# EAGLE design AS3364_waveform_VCA_0402_DIL_v1.0 (EAGLE 7.7.0)
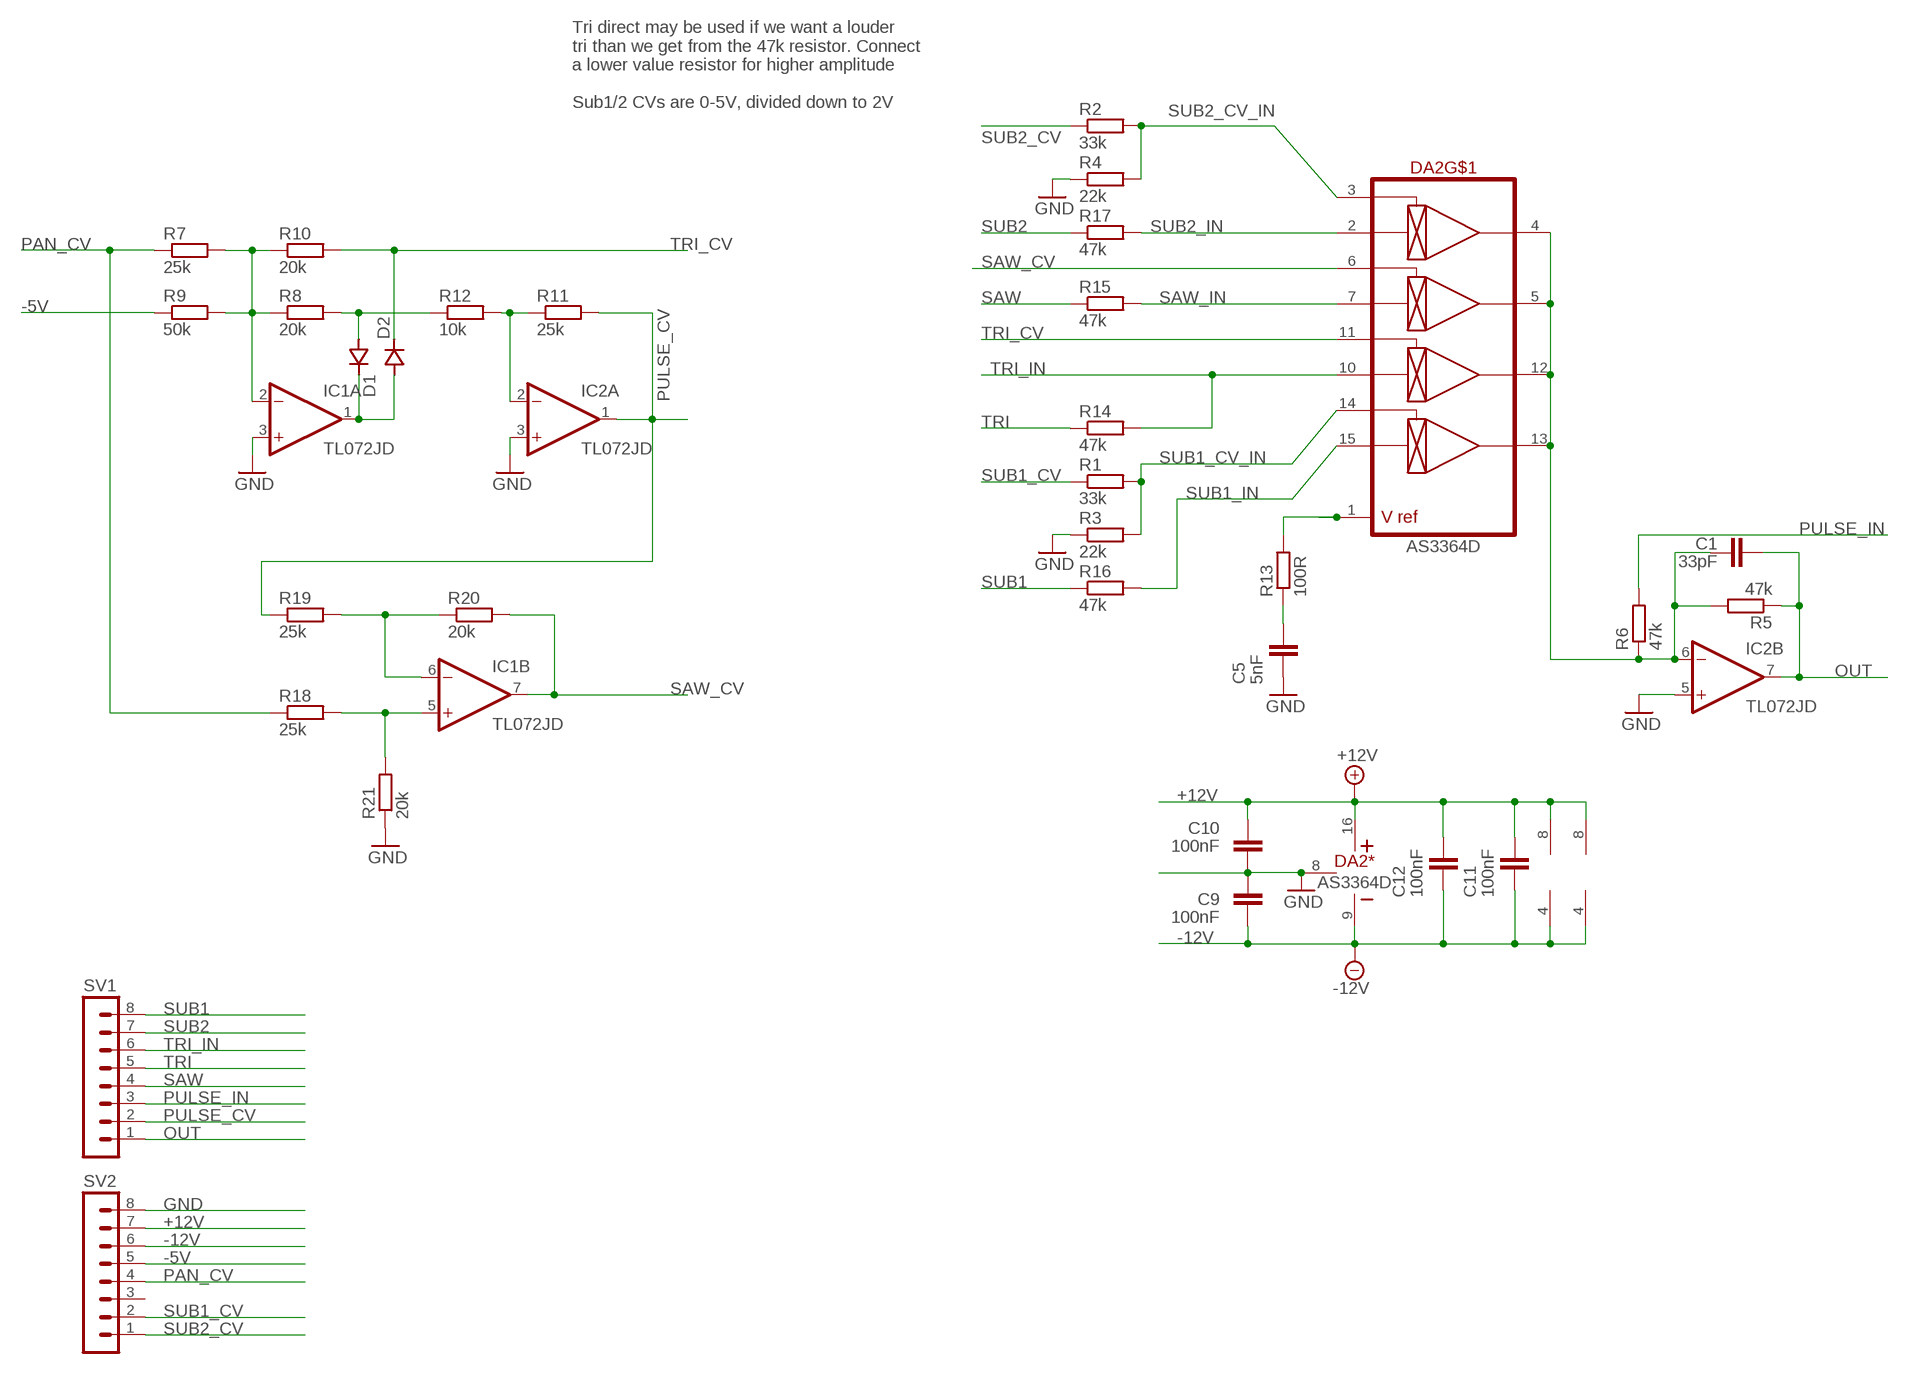
[diagram p0: schematic, sheet 1]

## Parts
C1  33pF  C-EUC0402  [C0402]
C5  5nF  C-EUC0402  [C0402]
C9  100nF  C-EUC0402  [C0402]
C10  100nF  C-EUC0402  [C0402]
C11  100nF  C-EUC0402  [C0402]
C12  100nF  C-EUC0402  [C0402]
D1  DIODESOD323  [SOD323J]
D2  DIODESOD323  [SOD323J]
DA2  AS3364D  [DIL16J]
IC1  TL072JD  [SO08J]
IC2  TL072JD  [SO08J]
R1  33k  R-EU_R0402  [R0402]
R2  33k  R-EU_R0402  [R0402]
R3  22k  R-EU_R0402  [R0402]
R4  22k  R-EU_R0402  [R0402]
R5  47k  R-EU_R0402  [R0402]
R6  47k  R-EU_R0402  [R0402]
R7  25k  R-EU_R0402  [R0402]
R8  20k  R-EU_R0402  [R0402]
R9  50k  R-EU_R0402  [R0402]
R10  20k  R-EU_R0402  [R0402]
R11  25k  R-EU_R0402  [R0402]
R12  10k  R-EU_R0402  [R0402]
R13  100R  R-EU_R0402  [R0402]
R14  47k  R-EU_R0402  [R0402]
R15  47k  R-EU_R0402  [R0402]
R16  47k  R-EU_R0402  [R0402]
R17  47k  R-EU_R0402  [R0402]
R18  25k  R-EU_R0402  [R0402]
R19  25k  R-EU_R0402  [R0402]
R20  20k  R-EU_R0402  [R0402]
R21  20k  R-EU_R0402  [R0402]
SV1  MA08-1JP  [SIP-PIN08-1J]
SV2  MA08-1JP  [SIP-PIN08-1J]

## Nets
+12V: C10.2 C11.2 C12.2 DA2.16(*:V+) IC1.8(P:V+) IC2.8(P:V+) SV2.7
-5V: R9.1 SV2.5
-12V: C9.1 C11.1 C12.1 DA2.9(*:V-) IC1.4(P:V-) IC2.4(P:V-) SV2.6
GND: C5.1 C9.2 C10.1 DA2.8(*:GND) IC1.3(A:+IN) IC2.3(A:+IN) IC2.5(B:+IN) R3.1 R4.1 R21.1 SV2.8
MIX_BUS: C1.2 DA2.4(OUT1) DA2.5(OUT2) DA2.12(OUT3) DA2.13(OUT4) IC2.6(B:-IN) R5.2 R6.1
N$2: DA2.1(VREF) R13.2
N$6: D1.1(C) D2.2(A) IC1.1(A:OUT)
N$8: IC1.2(A:-IN) R7.2 R8.1 R9.2 R10.1
N$11: IC1.5(B:+IN) R18.2 R21.2
N$14: C5.2 R13.1
N$15: IC1.6(B:-IN) R19.2 R20.1
N$18: IC2.2(A:-IN) R11.1 R12.2
N$19: D1.2(A) R8.2 R12.1
OUT: C1.1 IC2.7(B:OUT) R5.1 SV1.1
PAN_CV: R7.1 R18.1 SV2.4
PULSE_CV: IC2.1(A:OUT) R11.2 R19.1 SV1.2
PULSE_IN: R6.2 SV1.3
SAW: R15.1 SV1.4
SAW_CV: DA2.6(CV2) IC1.7(B:OUT) R20.2
SAW_IN: DA2.7(IN2) R15.2
SUB1: R16.1 SV1.8
SUB1_CV: R1.1 SV2.2
SUB1_CV_IN: DA2.14(CV4) R1.2 R3.2
SUB1_IN: DA2.15(IN4) R16.2
SUB2: R17.1 SV1.7
SUB2_CV: R2.1 SV2.1
SUB2_CV_IN: DA2.3(CV1) R2.2 R4.2
SUB2_IN: DA2.2(IN1) R17.2
TRI: R14.1 SV1.5
TRI_CV: D2.1(C) DA2.11(CV3) R10.2
TRI_IN: DA2.10(IN3) R14.2 SV1.6
Unconnected: SV2.3

## Notes on the sheet
- Tri direct may be used if we want a louder 
  tri than we get from the 47k resistor. Connect
  a lower value resistor for higher amplitude
  
  Sub1/2 CVs are 0-5V, divided down to 2V

## Library data of the parts
C1 C5 C9-C12 = rcl:C-EU: CAPACITOR, European symbol; SPICEPREFIX: C
D1 D2 = joakim:DIODE: DIODE; MPN: CDSOD323-T05C; OC_FARNELL: 1824860; OC_NEWARK: 79R6078
DA2 = joakim:AS3364: AS3364 quad linear VCA, CEM3360 style. CV is 0 to 2V Vcc-Vee = 26V max, so +/-12V or +15V/-9V
IC1 IC2 = joakim:TL072J: OP AMP
R1-R21 = rcl:R-EU_: RESISTOR, European symbol; SPICEPREFIX: R
SV1 SV2 = joakim:MA08-1J: PIN HEADER

## Board
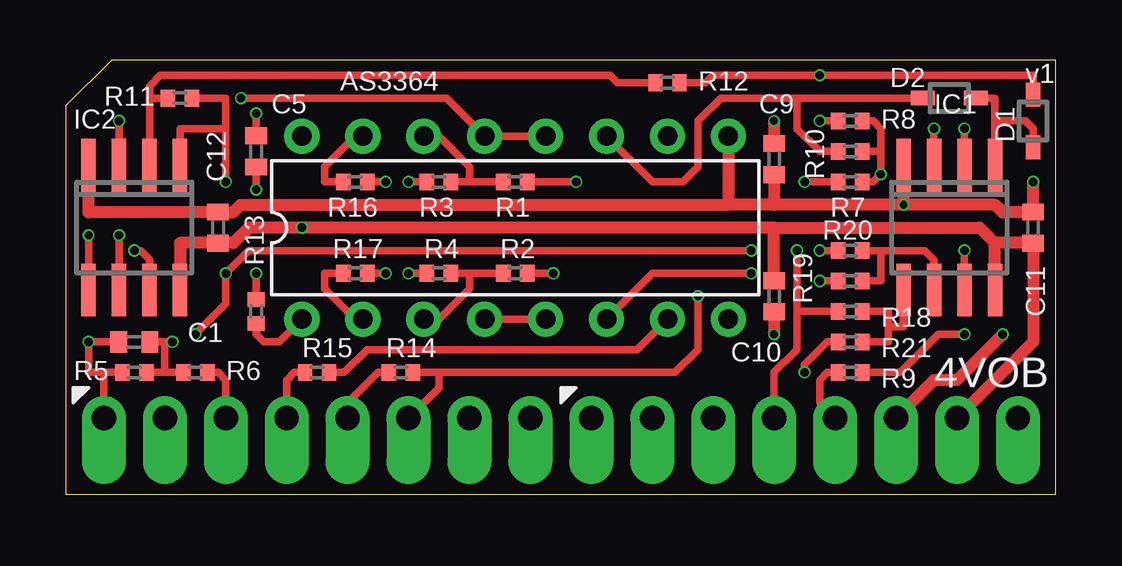
[diagram p1: board, top side]
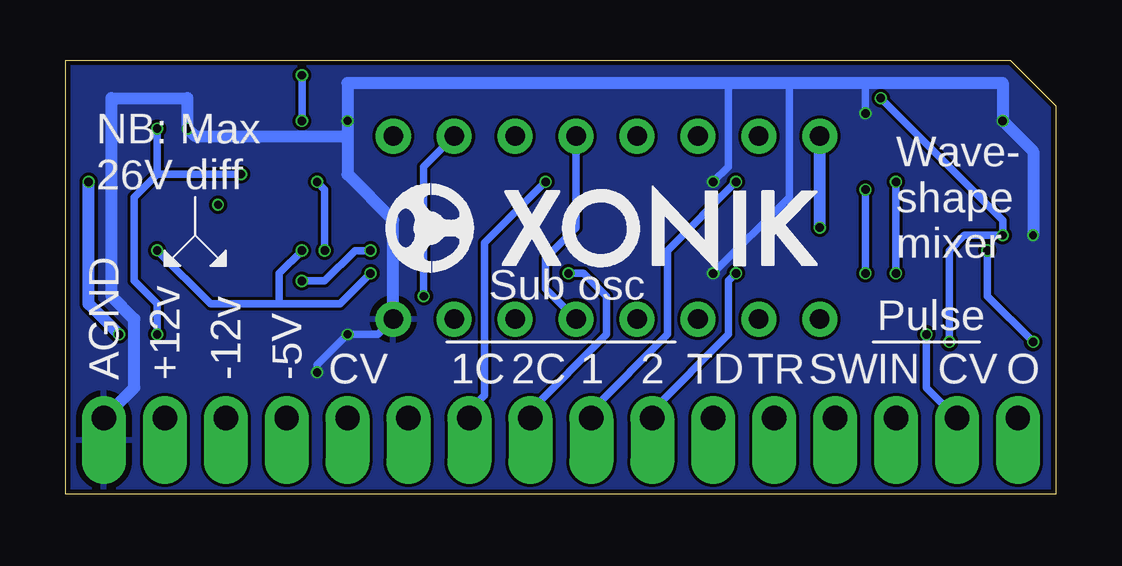
[diagram p2: board, bottom side, seen from below]

Size 41.27 x 18.1 mm. Coordinates in mm from the lower left corner, seen from the top.
Outline: 0,0 41.27,0 41.27,18.1 1.91,18.1 0,16.19 0,0
Copper layers (1*16): Top 0.035mm / dielectric 1.6mm / Bottom 0.035mm
Design rules "jlcpcb-2layers": minimum track width 5mil, minimum drill 0.3mm, track to track 5mil, track to pad 5mil, pad to pad 5mil, via to via 5mil, smd to smd 5mil, copper to edge 0.2mm, drill to drill 6mil, minimum pad ring 10mil, minimum via ring 3mil, stop-mask expansion 4mil, vias tented up to drill 0mil, thermal gap 10mil

### Footprints (pad centres in the part's own frame; a part is rotated, then mirrored left to right if it is on the bottom)
C0402 = smd 0.7 x 0.9: 1 -0.65,0; 2 0.65,0
SOD323J = smd 1 x 0.6: 1 -1.1,0; 2 1.1,0
DIL16J = drill 0.813: 1 -8.89,-3.81; 2 -6.35,-3.81; 3 -3.81,-3.81; 4 -1.27,-3.81; 5 1.27,-3.81; 6 3.81,-3.81; 7 6.35,-3.81; 8 8.89,-3.81; 9 8.89,3.81; 10 6.35,3.81; 11 3.81,3.81; 12 1.27,3.81; 13 -1.27,3.81; 14 -3.81,3.81; 15 -6.35,3.81; 16 -8.89,3.81
SO08J = smd 0.6 x 2.2: 1 -1.905,-2.6; 2 -0.635,-2.6; 3 0.635,-2.6; 4 1.905,-2.6; 5 1.905,2.6; 6 0.635,2.6; 7 -0.635,2.6; 8 -1.905,2.6
R0402 = smd 0.6 x 0.7: 1 -0.5,0; 2 0.5,0
SIP-PIN08-1J = drill 1.016 offset: 1 -8.89,0; 2 -6.35,0; 3 -3.81,0; 4 -1.27,0; 5 1.27,0; 6 3.81,0; 7 6.35,0; 8 8.89,0

### Placement (x,y rotation side)
C1  2.86,6.35 0 top
C5  7.94,14.29 270 top
C9  29.53,13.97 90 top
C10  29.53,8.26 90 top
C11  40.32,11.11 270 top
C12  6.35,11.11 270 top
D1  40.32,15.56 90 top
D2  36.83,16.51 0 top
DA2  18.73,11.11 0 top
IC1  36.83,11.11 180 top
IC2  2.86,11.11 180 top
R1  18.73,13.02 180 top
R2  18.73,9.21 180 top
R3  15.56,13.02 0 top
R4  15.56,9.21 0 top
R5  2.86,5.08 0 top
R6  5.4,5.08 0 top
R7  32.7,13.02 0 top
R8  32.7,15.56 180 top
R9  32.7,5.08 0 top
R10  32.7,14.29 180 top
R11  4.76,16.51 0 top
R12  25.08,17.14 180 top
R13  7.94,7.62 270 top
R14  13.97,5.08 0 top
R15  10.48,5.08 0 top
R16  12.06,13.02 180 top
R17  12.06,9.21 180 top
R18  32.7,7.62 0 top
R19  32.7,8.89 0 top
R20  32.7,10.16 180 top
R21  32.7,6.35 0 top
SV1  10.48,3.17 0 top
SV2  30.8,3.17 0 top
U$1  [XONIK_LOGO_18]  27.94,9.26 0 bottom

### Tracks (layer width: path | path; a pad name or v marks a point on that pad's centre or on a via)
+12V  (via drill 0.35)
  Top 0.508: IC2.8 4.76,10.48 6.35,10.48 | 29.53,11.11 38.1,11.11 38.73,10.48 | 29.53,11.11 v9.84,11.11 7.62,11.11 6.99,10.48 6.35,10.48 | C12.2 6.35,10.48 | C10.2 29.53,11.11 | IC1.8 38.73,10.48 | 38.73,10.48 40.31,10.48 C11.2 40.32,6.35 SV2.7
  Bottom 0.508: v9.84,11.11 DA2.16
-5V
  Top 0.305: SV2.5 31.43,3.81 31.43,4.76 31.75,5.08 R9.1
-12V  (via drill 0.33, 0.35)
  Top 0.508: IC1.4 v34.92,12.06 | IC2.4 0.95,11.75 6.35,11.75 C12.1 6.99,11.76 7.29,12.06 27.62,12.06 | v34.92,12.06 29.53,12.06 | 29.53,12.06 27.62,12.06 | C9.1 29.53,12.06 | v34.92,12.06 38.73,12.06 39.05,11.75 40.32,11.75 v40.32,13.02 C11.1 | DA2.9 27.62,12.06 | SV2.6 36.2,4.76 37.15,4.76 v39.05,6.67
  Bottom 0.508: v39.05,6.67 40.32,7.94 v40.32,13.02
GND  (via drill 0.33, 0.35)
  Top 0.305: C5.1 v7.94,15.88 | IC2.3 v2.22,15.56 | IC1.3 v36.2,15.24 | R21.1 31.75,6.35 30.8,5.4 v30.8,5.08 | v0.95,10.79 IC2.5 | R3.1 v14.29,13.02 | R4.1 v14.29,9.21
  Top 0.508: v29.53,15.56 C9.2 | C10.1 v29.53,6.67
  Bottom 0.305: v7.94,15.88 7.94,17.14 | DA2.8 28.26,6.67 v29.53,6.67 30.8,5.4 v30.8,5.08 | v14.29,13.02 13.65,13.65 13.65,17.14 | v14.29,9.21 11.11,12.38 11.11,17.14
  Bottom 0.508: v29.53,15.56 29.53,14.92 35.88,14.92 v36.2,15.24 36.2,16.51 39.37,16.51 39.37,8.26 38.42,7.3 38.42,4.45 SV2.8 | v0.95,10.79 0.95,14.29 v2.22,15.56 2.22,17.14 7.94,17.14 11.11,17.14 13.65,17.14 29.53,17.14 v29.53,15.56 | v29.53,15.56 29.53,13.34 27.62,11.43 DA2.8
  pour Bottom: 0,0 0,19.37 41.27,19.37 41.27,0
MIX_BUS  (via drill 0.35)
  Top 0.305: v7.3,16.51 15.88,16.51 DA2.13 DA2.12 | DA2.4 DA2.5 | v2.22,10.79 IC2.6 | R6.1 4.13,5.08 | 4.13,5.08 R5.2 | 4.13,6.35 C1.2 | 4.13,5.08 4.13,6.35 | v4.45,6.35 4.13,6.35
  Bottom 0.305: DA2.5 21.27,8.57 21.27,9.84 20,11.11 DA2.12 | v7.3,16.51 2.22,11.43 v2.22,10.79 3.81,10.79 4.45,10.16 v4.45,6.35
N$2
  Top 0.305: DA2.1 8.89,6.35 8.26,6.35 7.94,6.67 R13.2
N$6
  Top 0.305: D2.2 38.73,16.51 38.73,15.56 | D1.1 40.32,15.24 40.01,15.56 38.73,15.56 | IC1.1 38.73,15.56
N$8  (via drill 0.35)
  Top 0.305: IC1.2 v37.47,15.24 | R8.1 33.66,15.56 33.97,15.24 33.97,14.29 | 33.97,14.29 v33.97,13.34 33.66,13.02 R7.2 | R9.2 34.79,5.08 36.38,6.67 v37.47,6.67 | R10.1 33.97,14.29
  Bottom 0.305: 37.47,13.34 v33.97,13.34 | v37.47,15.24 37.47,13.34 | 37.47,13.34 38.42,12.38 38.42,8.89 37.47,7.94 v37.47,6.67
N$11
  Top 0.305: IC1.5 34.92,6.99 34.29,6.99 | R18.2 34.29,7.62 34.29,6.99 | R21.2 34.29,6.35 34.29,6.99
N$14  (via drill 0.35)
  Top 0.305: R13.1 v7.94,9.21 | C5.2 v7.94,12.7
  Bottom 0.305: v7.94,12.7 v7.94,9.21
N$15
  Top 0.305: IC1.6 36.2,9.78 35.82,10.16 34.29,10.16 34.16,10.16 33.97,10.16 | R19.2 33.97,8.89 33.97,10.16 | R20.1 33.97,10.16
N$18
  Top 0.305: R11.1 3.49,16.51 | IC2.2 3.49,16.51 | R12.2 23,17.14 22.68,17.46 3.94,17.46 3.49,17.01 3.49,16.51
N$19  (via drill 0.35)
  Top 0.305: D1.2 40.32,17.46 v31.43,17.46 26.99,17.46 26.67,17.14 R12.1 | R8.2 v31.43,15.56
  Bottom 0.305: v31.43,17.46 v31.43,15.56
OUT  (via drill 0.35)
  Top 0.305: IC2.7 3.49,9.78 3.12,10.16 v2.86,10.16 | C1.1 v0.95,6.35 0.95,5.08 1.59,5.08 | SV1.1 1.59,5.08 | R5.1 1.59,5.08
  Bottom 0.305: v2.86,10.16 2.86,8.26 v0.95,6.35
PAN_CV  (via drill 0.35)
  Top 0.305: R18.1 30.48,7.62 | 30.48,7.62 30.48,6.03 29.53,5.08 SV2.4 | v30.48,10.16 30.48,7.62 | v30.8,13.02 R7.1
  Bottom 0.305: v30.8,13.02 30.48,12.7 v30.48,10.16
PULSE_CV  (via drill 0.35)
  Top 0.305: v6.67,13.02 6.67,15.24 | 6.67,15.24 4.76,15.24 IC2.1 | 6.67,15.24 6.67,16.51 R11.2 | v5.4,6.67 6.67,7.94 v6.67,9.21 7.62,10.16 v28.57,10.16 | R19.1 v31.43,8.89
  Bottom 0.305: v6.67,13.02 v6.67,9.21 | v28.57,10.16 29.21,10.16 30.48,8.89 v31.43,8.89 | v5.4,6.67 5.4,4.45 SV1.2
PULSE_IN
  Top 0.305: SV1.3 6.67,4.76 6.35,5.08 R6.2
SAW
  Top 0.305: SV1.4 9.21,4.76 9.53,5.08 R15.1
SAW_CV  (via drill 0.35)
  Top 0.305: v37.47,10.16 IC1.7 | R20.2 v31.43,10.16 | DA2.6 24.45,9.21 v28.57,9.21
  Bottom 0.305: v28.57,9.21 29.84,7.94 32.38,7.94 | v37.47,10.16 35.24,7.94 32.38,7.94 | v31.43,10.16 32.38,9.21 32.38,7.94
SAW_IN
  Top 0.305: R15.2 11.61,5.08 12.56,6.03 23.81,6.03 DA2.7
SUB1  (via drill 0.35)
  Top 0.305: v13.34,13.02 R16.1
  Bottom 0.305: SV1.8 19.37,3.49 16.19,6.67 16.19,10.16 v13.34,13.02
SUB1_CV  (via drill 0.35)
  Top 0.305: v21.27,13.02 R1.1
  Bottom 0.305: v21.27,13.02 23.81,10.48 23.81,4.13 24.45,3.49 SV2.2
SUB1_CV_IN
  Top 0.305: R1.2 16.83,13.02 | 16.83,13.02 R3.2 | 16.83,13.02 16.83,13.65 15.56,14.92 DA2.14
SUB1_IN
  Top 0.305: DA2.15 12.06,14.92 10.79,13.65 10.79,13.02 R16.2
SUB2  (via drill 0.35)
  Top 0.305: v13.34,9.21 R17.1
  Bottom 0.305: SV1.7 16.83,3.49 13.65,6.67 13.65,8.89 v13.34,9.21
SUB2_CV  (via drill 0.35)
  Top 0.305: v20.32,9.21 R2.1
  Bottom 0.305: SV2.1 21.91,3.49 18.73,6.67 18.73,8.26 19.68,9.21 v20.32,9.21
SUB2_CV_IN
  Top 0.305: DA2.3 15.56,7.3 16.83,8.57 16.83,9.21 | R2.2 16.83,9.21 | 16.83,9.21 R4.2
SUB2_IN
  Top 0.305: DA2.2 12.06,7.3 10.79,8.57 10.79,9.21 R17.2
TRI
  Top 0.305: R14.1 13.02,5.08 11.75,3.81 SV1.5
TRI_CV
  Top 0.305: 30.48,16.51 27.3,16.51 26.35,15.56 26.35,13.65 25.72,13.02 24.45,13.02 DA2.11 | R10.2 31.43,14.29 30.48,15.24 30.48,16.51 | 30.48,16.51 D2.1
TRI_IN  (via drill 0.35)
  Top 0.305: R14.2 15.56,5.08 | 15.56,5.08 25.4,5.08 26.35,6.03 v26.35,8.26 | SV1.6 15.56,4.45 15.56,5.08
  Bottom 0.305: DA2.10 26.35,13.65 v26.35,8.26

### Text on the board
tNames: AS3364 | v1 | 4VOB
bNames: NB: Max / 26V diff | Wave- / shape / mixer | Sub osc | Pulse | O | CV | IN | SW | TR | TD | 2 | 1 | 2C | 1C | CV | -5V | -12v | +12v | AGND